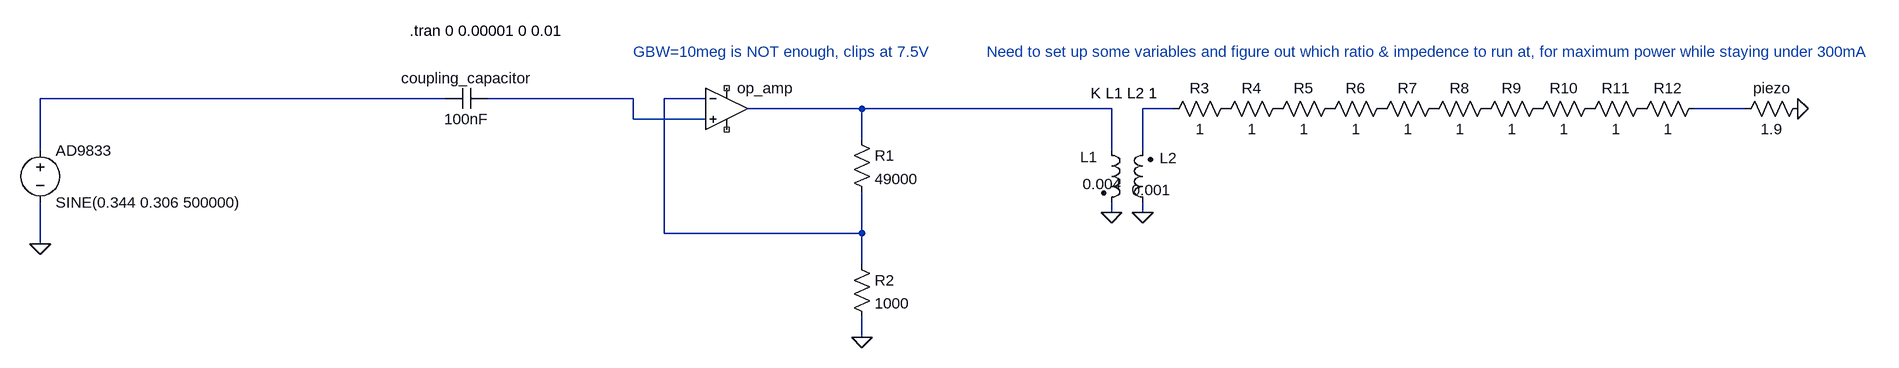
[diagram p0: schematic driver-circuit.asc]
driver-circuit.asc, the LTspice schematic file:
Version 4
SHEET 1 3012 1140
WIRE 800 192 176 192
WIRE 1088 192 864 192
WIRE 1200 192 1136 192
WIRE 1440 208 1264 208
WIRE 1824 208 1440 208
WIRE 1920 208 1872 208
WIRE 2800 208 2720 208
WIRE 1088 224 1088 192
WIRE 1200 224 1088 224
WIRE 1440 256 1440 208
WIRE 176 272 176 192
WIRE 1824 272 1824 208
WIRE 1872 272 1872 208
WIRE 1824 368 1824 352
WIRE 1872 368 1872 352
WIRE 1136 400 1136 192
WIRE 1440 400 1440 336
WIRE 1440 400 1136 400
WIRE 176 416 176 352
WIRE 1440 448 1440 400
WIRE 1440 560 1440 528
FLAG 176 416 0
FLAG 1440 560 0
FLAG 1872 368 0
FLAG 1824 368 0
FLAG 2880 208 0
SYMBOL voltage 176 256 R0
SYMATTR InstName AD9833
SYMATTR Value SINE(0.344 0.306 500000)
SYMBOL Cap 864 176 R90
WINDOW 0 0 32 VBottom 2
WINDOW 3 32 32 VTop 2
SYMATTR InstName coupling_capacitor
SYMATTR Value 100nF
SYMBOL OpAmps/UniversalOpAmp 1232 208 R0
SYMATTR InstName op_amp
SYMATTR Value2 Avol=1Meg GBW=100Meg Vos=0
SYMBOL Res 1424 240 R0
SYMATTR InstName R1
SYMATTR Value 49000
SYMBOL Res 1424 432 R0
SYMATTR InstName R2
SYMATTR Value 1000
SYMBOL ind2 1808 256 R0
WINDOW 0 -32 26 Left 2
WINDOW 3 -28 68 Left 2
SYMATTR InstName L1
SYMATTR Value 0.004
SYMBOL ind2 1888 368 R180
WINDOW 0 -37 84 Left 2
WINDOW 3 -28 35 Left 2
SYMATTR InstName L2
SYMATTR Value 0.001
SYMBOL Res 2896 192 R90
WINDOW 0 0 56 VBottom 2
WINDOW 3 32 56 VTop 2
SYMATTR InstName piezo
SYMATTR Value 1.9
SYMBOL Res 2016 192 R90
WINDOW 0 0 56 VBottom 2
WINDOW 3 32 56 VTop 2
SYMATTR InstName R3
SYMATTR Value 1
SYMBOL Res 2096 192 R90
WINDOW 0 0 56 VBottom 2
WINDOW 3 32 56 VTop 2
SYMATTR InstName R4
SYMATTR Value 1
SYMBOL Res 2176 192 R90
WINDOW 0 0 56 VBottom 2
WINDOW 3 32 56 VTop 2
SYMATTR InstName R5
SYMATTR Value 1
SYMBOL Res 2256 192 R90
WINDOW 0 0 56 VBottom 2
WINDOW 3 32 56 VTop 2
SYMATTR InstName R6
SYMATTR Value 1
SYMBOL Res 2336 192 R90
WINDOW 0 0 56 VBottom 2
WINDOW 3 32 56 VTop 2
SYMATTR InstName R7
SYMATTR Value 1
SYMBOL Res 2416 192 R90
WINDOW 0 0 56 VBottom 2
WINDOW 3 32 56 VTop 2
SYMATTR InstName R8
SYMATTR Value 1
SYMBOL Res 2496 192 R90
WINDOW 0 0 56 VBottom 2
WINDOW 3 32 56 VTop 2
SYMATTR InstName R9
SYMATTR Value 1
SYMBOL Res 2576 192 R90
WINDOW 0 0 56 VBottom 2
WINDOW 3 32 56 VTop 2
SYMATTR InstName R10
SYMATTR Value 1
SYMBOL Res 2656 192 R90
WINDOW 0 0 56 VBottom 2
WINDOW 3 32 56 VTop 2
SYMATTR InstName R11
SYMATTR Value 1
SYMBOL Res 2736 192 R90
WINDOW 0 0 56 VBottom 2
WINDOW 3 32 56 VTop 2
SYMATTR InstName R12
SYMATTR Value 1
TEXT 744 88 Left 2 !.tran 0 0.00001 0 0.01
TEXT 1792 184 Left 2 !K L1 L2 1
TEXT 1088 120 Left 2 ;GBW=10meg is NOT enough, clips at 7.5V
TEXT 1632 120 Left 2 ;Need to set up some variables and figure out which ratio & impedence to run at, for maximum power while staying under 300mA

The netlist it stands for:
* driver-circuit.asc
V§AD9833 N001 0 SINE(0.344 0.306 500000)
coupling_capacitor N002 N001 100nF
Xop_amp N002 N003 NC_01 NC_02 N004 level1 Avol=1Meg GBW=100Meg Vos=0 En=0 Enk=0 In=0 Ink=0 Rin=500Meg  ; pins In+ In- V+ V- OUT
R1 N004 N003 49000
R2 N003 0 1000
L1 N004 0 0.004
L2 0 N005 0.001
R§piezo 0 N006 1.9
R3 P001 N005 1
R4 P002 P001 1
R5 P003 P002 1
R6 P004 P003 1
R7 P005 P004 1
R8 P006 P005 1
R9 P007 P006 1
R10 P008 P007 1
R11 P009 P008 1
R12 N006 P009 1
.tran 0 0.00001 0 0.01
K L1 L2 1
* GBW=10meg is NOT enough, clips at 7.5V
* Need to set up some variables and figure out which ratio & impedence to run at, for maximum power while staying under 300mA
.lib UniversalOpAmp1.lib
.backanno
.end